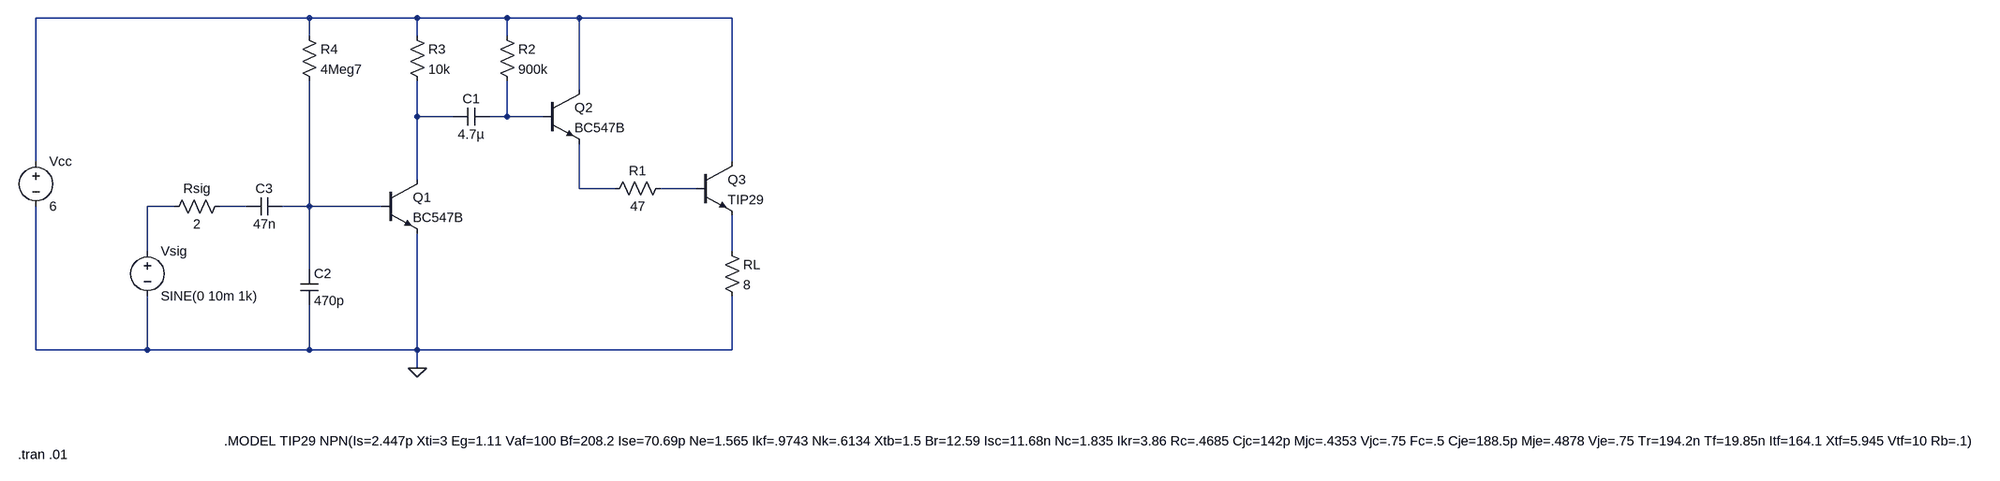
[diagram p0: schematic TBJ - Radio - AM.asc]
TBJ - Radio - AM.asc, the LTspice schematic file:
Version 4
SHEET 1 3324 680
WIRE 16 -144 -512 -144
WIRE 208 -144 16 -144
WIRE 368 -144 208 -144
WIRE 496 -144 368 -144
WIRE 768 -144 496 -144
WIRE 16 -112 16 -144
WIRE 208 -112 208 -144
WIRE 368 -112 368 -144
WIRE 496 -16 496 -144
WIRE 208 32 208 -32
WIRE 272 32 208 32
WIRE 368 32 368 -32
WIRE 368 32 336 32
WIRE 432 32 368 32
WIRE -512 112 -512 -144
WIRE 768 112 768 -144
WIRE 208 144 208 32
WIRE 496 160 496 80
WIRE 560 160 496 160
WIRE 704 160 640 160
WIRE -224 192 -272 192
WIRE -96 192 -144 192
WIRE 16 192 16 -32
WIRE 16 192 -32 192
WIRE 144 192 16 192
WIRE -272 272 -272 192
WIRE 768 272 768 208
WIRE 16 304 16 192
WIRE -512 448 -512 192
WIRE -272 448 -272 352
WIRE -272 448 -512 448
WIRE 16 448 16 368
WIRE 16 448 -272 448
WIRE 208 448 208 240
WIRE 208 448 16 448
WIRE 768 448 768 352
WIRE 768 448 208 448
WIRE 208 480 208 448
FLAG 208 480 0
SYMBOL npn 144 144 R0
SYMATTR InstName Q1
SYMATTR Value BC547B
SYMBOL npn 432 -16 R0
SYMATTR InstName Q2
SYMATTR Value BC547B
SYMBOL npn 704 112 R0
SYMATTR InstName Q3
SYMATTR Value TIP29
SYMBOL res 752 256 R0
SYMATTR InstName RL
SYMATTR Value 8
SYMBOL res 656 144 R90
WINDOW 0 0 56 VBottom 2
WINDOW 3 32 56 VTop 2
SYMATTR InstName R1
SYMATTR Value 47
SYMBOL res 352 -128 R0
SYMATTR InstName R2
SYMATTR Value 900k
SYMBOL res 192 -128 R0
SYMATTR InstName R3
SYMATTR Value 10k
SYMBOL res 0 -128 R0
SYMATTR InstName R4
SYMATTR Value 4Meg7
SYMBOL cap 336 16 R90
WINDOW 0 0 32 VBottom 2
WINDOW 3 32 32 VTop 2
SYMATTR InstName C1
SYMATTR Value 4.7µ
SYMBOL cap 0 304 R0
SYMATTR InstName C2
SYMATTR Value 470p
SYMBOL cap -32 176 R90
WINDOW 0 0 32 VBottom 2
WINDOW 3 32 32 VTop 2
SYMATTR InstName C3
SYMATTR Value 47n
SYMBOL voltage -272 256 R0
WINDOW 123 0 0 Left 0
WINDOW 39 0 0 Left 0
SYMATTR InstName Vsig
SYMATTR Value SINE(0 10m 1k)
SYMBOL voltage -512 96 R0
WINDOW 123 0 0 Left 0
WINDOW 39 0 0 Left 0
SYMATTR InstName Vcc
SYMATTR Value 6
SYMBOL res -128 176 R90
WINDOW 0 0 56 VBottom 2
WINDOW 3 32 56 VTop 2
SYMATTR InstName Rsig
SYMATTR Value 2
TEXT -136 640 Left 2 !.MODEL TIP29 NPN(Is=2.447p Xti=3 Eg=1.11 Vaf=100 Bf=208.2 Ise=70.69p Ne=1.565 Ikf=.9743 Nk=.6134 Xtb=1.5 Br=12.59 Isc=11.68n Nc=1.835 Ikr=3.86 Rc=.4685 Cjc=142p Mjc=.4353 Vjc=.75 Fc=.5 Cje=188.5p Mje=.4878 Vje=.75 Tr=194.2n Tf=19.85n Itf=164.1 Xtf=5.945 Vtf=10 Rb=.1)
TEXT -544 664 Left 2 !.tran .01

The netlist it stands for:
* TBJ - Radio - AM.asc
Q1 N002 N008 0 0 BC547B
Q2 N001 N003 N004 0 BC547B
Q3 N001 N005 N009 0 TIP29
RL N009 0 8
R1 N005 N004 47
R2 N001 N003 900k
R3 N001 N002 10k
R4 N001 N008 4Meg7
C1 N003 N002 4.7µ
C2 N008 0 470p
C3 N008 N007 47n
Vsig N006 0 SINE(0 10m 1k)
Vcc N001 0 6
Rsig N007 N006 2
.model NPN NPN
.model PNP PNP
.lib standard.bjt
.MODEL TIP29 NPN(Is=2.447p Xti=3 Eg=1.11 Vaf=100 Bf=208.2 Ise=70.69p Ne=1.565 Ikf=.9743 Nk=.6134 Xtb=1.5 Br=12.59 Isc=11.68n Nc=1.835 Ikr=3.86 Rc=.4685 Cjc=142p Mjc=.4353 Vjc=.75 Fc=.5 Cje=188.5p Mje=.4878 Vje=.75 Tr=194.2n Tf=19.85n Itf=164.1 Xtf=5.945 Vtf=10 Rb=.1)
.tran .01
.backanno
.end